# EasyEDA schematic SCH_286 BreakOut Board_2023-05-22.json
TITLE: 286 BreakOut Board; REV: 1.1; Date: 2023-03-27; Sheet: 1/1; Drawn By: Dom Emond; Company: Your Company
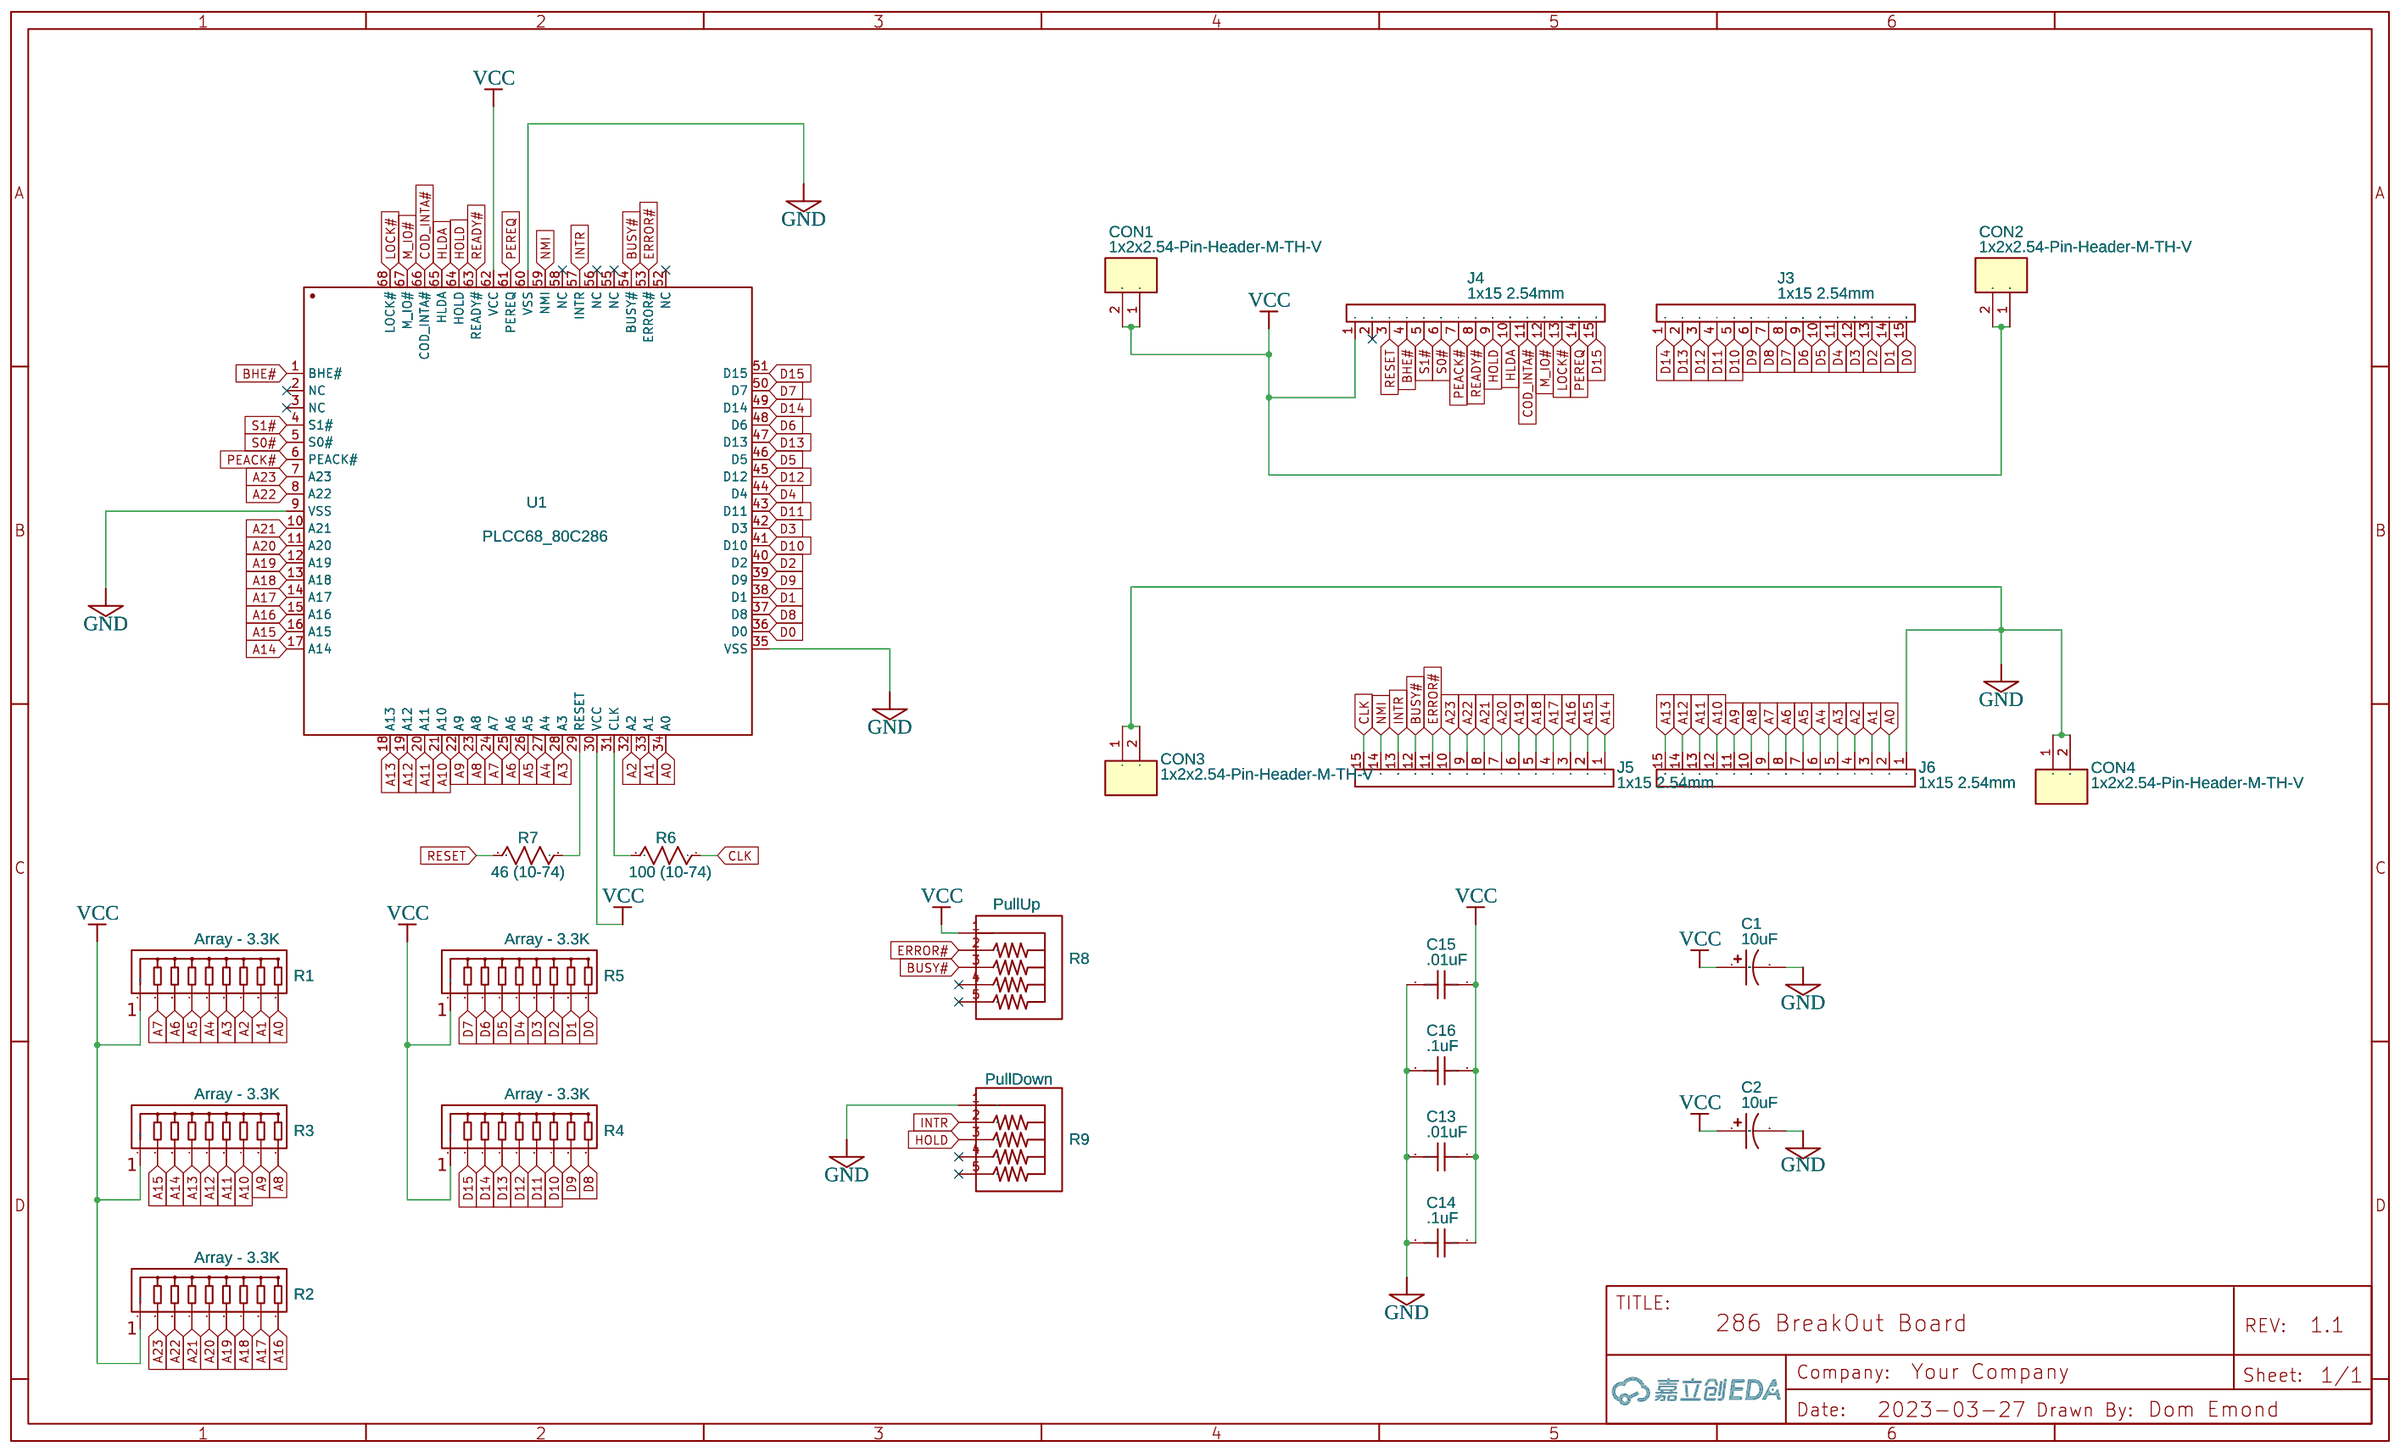
[diagram p0: schematic sheet]

## Parts
C1  10uF  [CAP-D6.3×F2.5]
C2  10uF  [CAP-D6.3×F2.5]
C13  .01uF  [RAD-0.1]
C14  .1uF  [RAD-0.1]
C15  .01uF  [RAD-0.1]
C16  .1uF  [RAD-0.1]
CON1  1x2x2.54-Pin-Header-M-TH-V  [1X2X2.54-PIN-HEADER-M-TH-V]
CON2  1x2x2.54-Pin-Header-M-TH-V  [1X2X2.54-PIN-HEADER-M-TH-V]
CON3  1x2x2.54-Pin-Header-M-TH-V  [1X2X2.54-PIN-HEADER-M-TH-V]
CON4  1x2x2.54-Pin-Header-M-TH-V  [1X2X2.54-PIN-HEADER-M-TH-V]
J3  1x15 2.54mm  [1X15 2.54MM HEADER]
J4  1x15 2.54mm  [1X15 2.54MM HEADER]
J5  1x15 2.54mm  [1X15 2.54MM HEADER]
J6  1x15 2.54mm  [1X15 2.54MM HEADER]
R1  Array - 3.3K  [8 RESISTOR ARRAY 9PIN SIP]
R2  Array - 3.3K  [8 RESISTOR ARRAY 9PIN SIP]
R3  Array - 3.3K  [8 RESISTOR ARRAY 9PIN SIP]
R4  Array - 3.3K  [8 RESISTOR ARRAY 9PIN SIP]
R5  Array - 3.3K  [8 RESISTOR ARRAY 9PIN SIP]
R6  100 (10-74)  [R_AXIAL-0.3]
R7  46 (10-74)  [R_AXIAL-0.3]
R8  PullUp  [RESISTOR ARRAY-5PIN]
R9  PullDown  [RESISTOR ARRAY-5PIN]
U1  PLCC68_80C286  [PLCC_68_SOCKET]

## Library data of the parts
C1 C2 = CE_TH_D6.3×F2.5_US: Contributor: LCEDA_Lib
C13-C16 = C_RAD-0.1_US: Contributor: LCEDA_Lib
CON1-CON4 = 1x2x2.54-Pin-Header-M-TH-V: Contributor: Arateck
J3-J6 = 1x15 2.54mm: Contributor: s4Lights
R1-R5 = RESISTOR-8XARRAY_SIP: Contributor: KiCAD; license: https://www.gnu.org/licenses/lgpl-2.1.html
R6 R7 = RESISTOR-1/4W: Contributor: pacs170106
R8 R9 = 4 Resistor Array: Manufacturer Part: TT Electronics; Supplier Part: undefined; Contributor: nikodwoof
U1 = PLCC68_PA68: Manufacturer: HumanData; Manufacturer Part: PA68; Supplier Part: PA68; Contributor: ozawa.atmos

## Nets
GND: C1.2 C2.2 C13.2 C14.2 C15.2 C16.2 CON3.1 CON3.2 CON4.1 CON4.2 J6.1 R9.1 U1.9(VSS) U1.35(VSS) U1.60(VSS)
VCC: C1.1 C2.1 C13.1 C14.1 C15.1 C16.1 CON1.1 CON1.2 CON2.1 CON2.2 J4.1 R1.1(Com) R2.1(Com) R3.1(Com) R4.1(Com) R5.1(Com) R8.1 U1.30(VCC) U1.62(VCC)
A0: J6.2 R1.9 U1.34(A0)
A1: J6.3 R1.8 U1.33(A1)
A2: J6.4 R1.7 U1.32(A2)
A3: J6.5 R1.6 U1.28(A3)
A4: J6.6 R1.5 U1.27(A4)
A5: J6.7 R1.4 U1.26(A5)
A6: J6.8 R1.3 U1.25(A6)
A7: J6.9 R1.2 U1.24(A7)
A8: J6.10 R3.9 U1.23(A8)
A9: J6.11 R3.8 U1.22(A9)
A10: J6.12 R3.7 U1.21(A10)
A11: J6.13 R3.6 U1.20(A11)
A12: J6.14 R3.5 U1.19(A12)
A13: J6.15 R3.4 U1.18(A13)
A14: J5.1 R3.3 U1.17(A14)
A15: J5.2 R3.2 U1.16(A15)
A16: J5.3 R2.9 U1.15(A16)
A17: J5.4 R2.8 U1.14(A17)
A18: J5.5 R2.7 U1.13(A18)
A19: J5.6 R2.6 U1.12(A19)
A20: J5.7 R2.5 U1.11(A20)
A21: J5.8 R2.4 U1.10(A21)
A22: J5.9 R2.3 U1.8(A22)
A23: J5.10 R2.2 U1.7(A23)
BHE#: J4.4 U1.1(BHE#)
BUSY#: J5.12 R8.3 U1.54(BUSY#)
CLK: J5.15 R6.1
COD_INTA#: J4.11 U1.66(COD_INTA#)
D0: J3.15 R5.9 U1.36(D0)
D1: J3.14 R5.8 U1.38(D1)
D2: J3.13 R5.7 U1.40(D2)
D3: J3.12 R5.6 U1.42(D3)
D4: J3.11 R5.5 U1.44(D4)
D5: J3.10 R5.4 U1.46(D5)
D6: J3.9 R5.3 U1.48(D6)
D7: J3.8 R5.2 U1.50(D7)
D8: J3.7 R4.9 U1.37(D8)
D9: J3.6 R4.8 U1.39(D9)
D10: J3.5 R4.7 U1.41(D10)
D11: J3.4 R4.6 U1.43(D11)
D12: J3.3 R4.5 U1.45(D12)
D13: J3.2 R4.4 U1.47(D13)
D14: J3.1 R4.3 U1.49(D14)
D15: J4.15 R4.2 U1.51(D15)
ERROR#: J5.11 R8.2 U1.53(ERROR#)
HLDA: J4.10 U1.65(HLDA)
HOLD: J4.9 R9.3 U1.64(HOLD)
INTR: J5.13 R9.2 U1.57(INTR)
LOCK#: J4.13 U1.68(LOCK#)
M_IO#: J4.12 U1.67(M_IO#)
NMI: J5.14 U1.59(NMI)
PEACK#: J4.7 U1.6(PEACK#)
PEREQ: J4.14 U1.61(PEREQ)
READY#: J4.8 U1.63(READY#)
RESET: J4.3 R7.2
S0#: J4.6 U1.5(S0#)
S1#: J4.5 U1.4(S1#)
Net-(R6-2): R6.2 U1.31(CLK)
Net-(R7-1): R7.1 U1.29(RESET)

Not connected (* = marked no-connect by the designer): J4 2*; R8 4* 5*; R9 4* 5*; U1 2(NC)* 3(NC)* 52(NC)* 55(NC)* 56(NC)* 58(NC)*
